# Altium schematic sheet Pressure_Sensor.SchDoc
size A
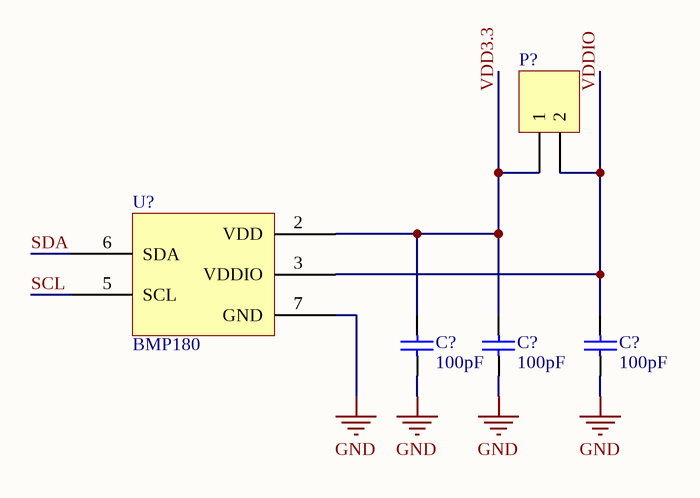
[diagram p0: Pressure_Sensor.SchDoc]

## Parts
(Parts that share a designator on the sheet are numbered #1, #2 ... from top to bottom, then left to right.)
C?#1  value 100pF  [C1206]  (hidden comment: Cap Semi)
C?#2  value 100pF  [C1206]  (hidden comment: Cap Semi)
C?#3  value 100pF  [C1206]  (hidden comment: Cap Semi)
P?  Header 2  [HDR1X2]  (value not drawn)
U?  BMP180  [BMP180]

## Nets
GND: C?#1.1 C?#2.1 C?#3.1 U?.7(GND)
SCL: U?.5(SCL)
SDA: U?.6(SDA)
VDD3.3: C?#1.2 C?#2.2 P?.1 U?.2(VDD)
VDDIO: C?#3.2 P?.2 U?.3(VDDIO)

## Library data of the parts
C?#1-C?#3 = Cap Semi: Capacitor (Semiconductor SIM Model); Published: 8-Jun-2000; LatestRevisionDate: 29-May-2009; LatestRevisionNote: IPC-7351 Footprint Added.; PackageReference: C1206; Publisher: Altium Limited; PackageDescription: Chip Capacitor
P? = Header 2: Header, 2-Pin; LatestRevisionDate: 17-Jul-2002; LatestRevisionNote: Re-released for DXP Platform.; Publisher: Altium Limited